# Altium project DISCO Motor Speed Drive 3-0002.PrjPcb
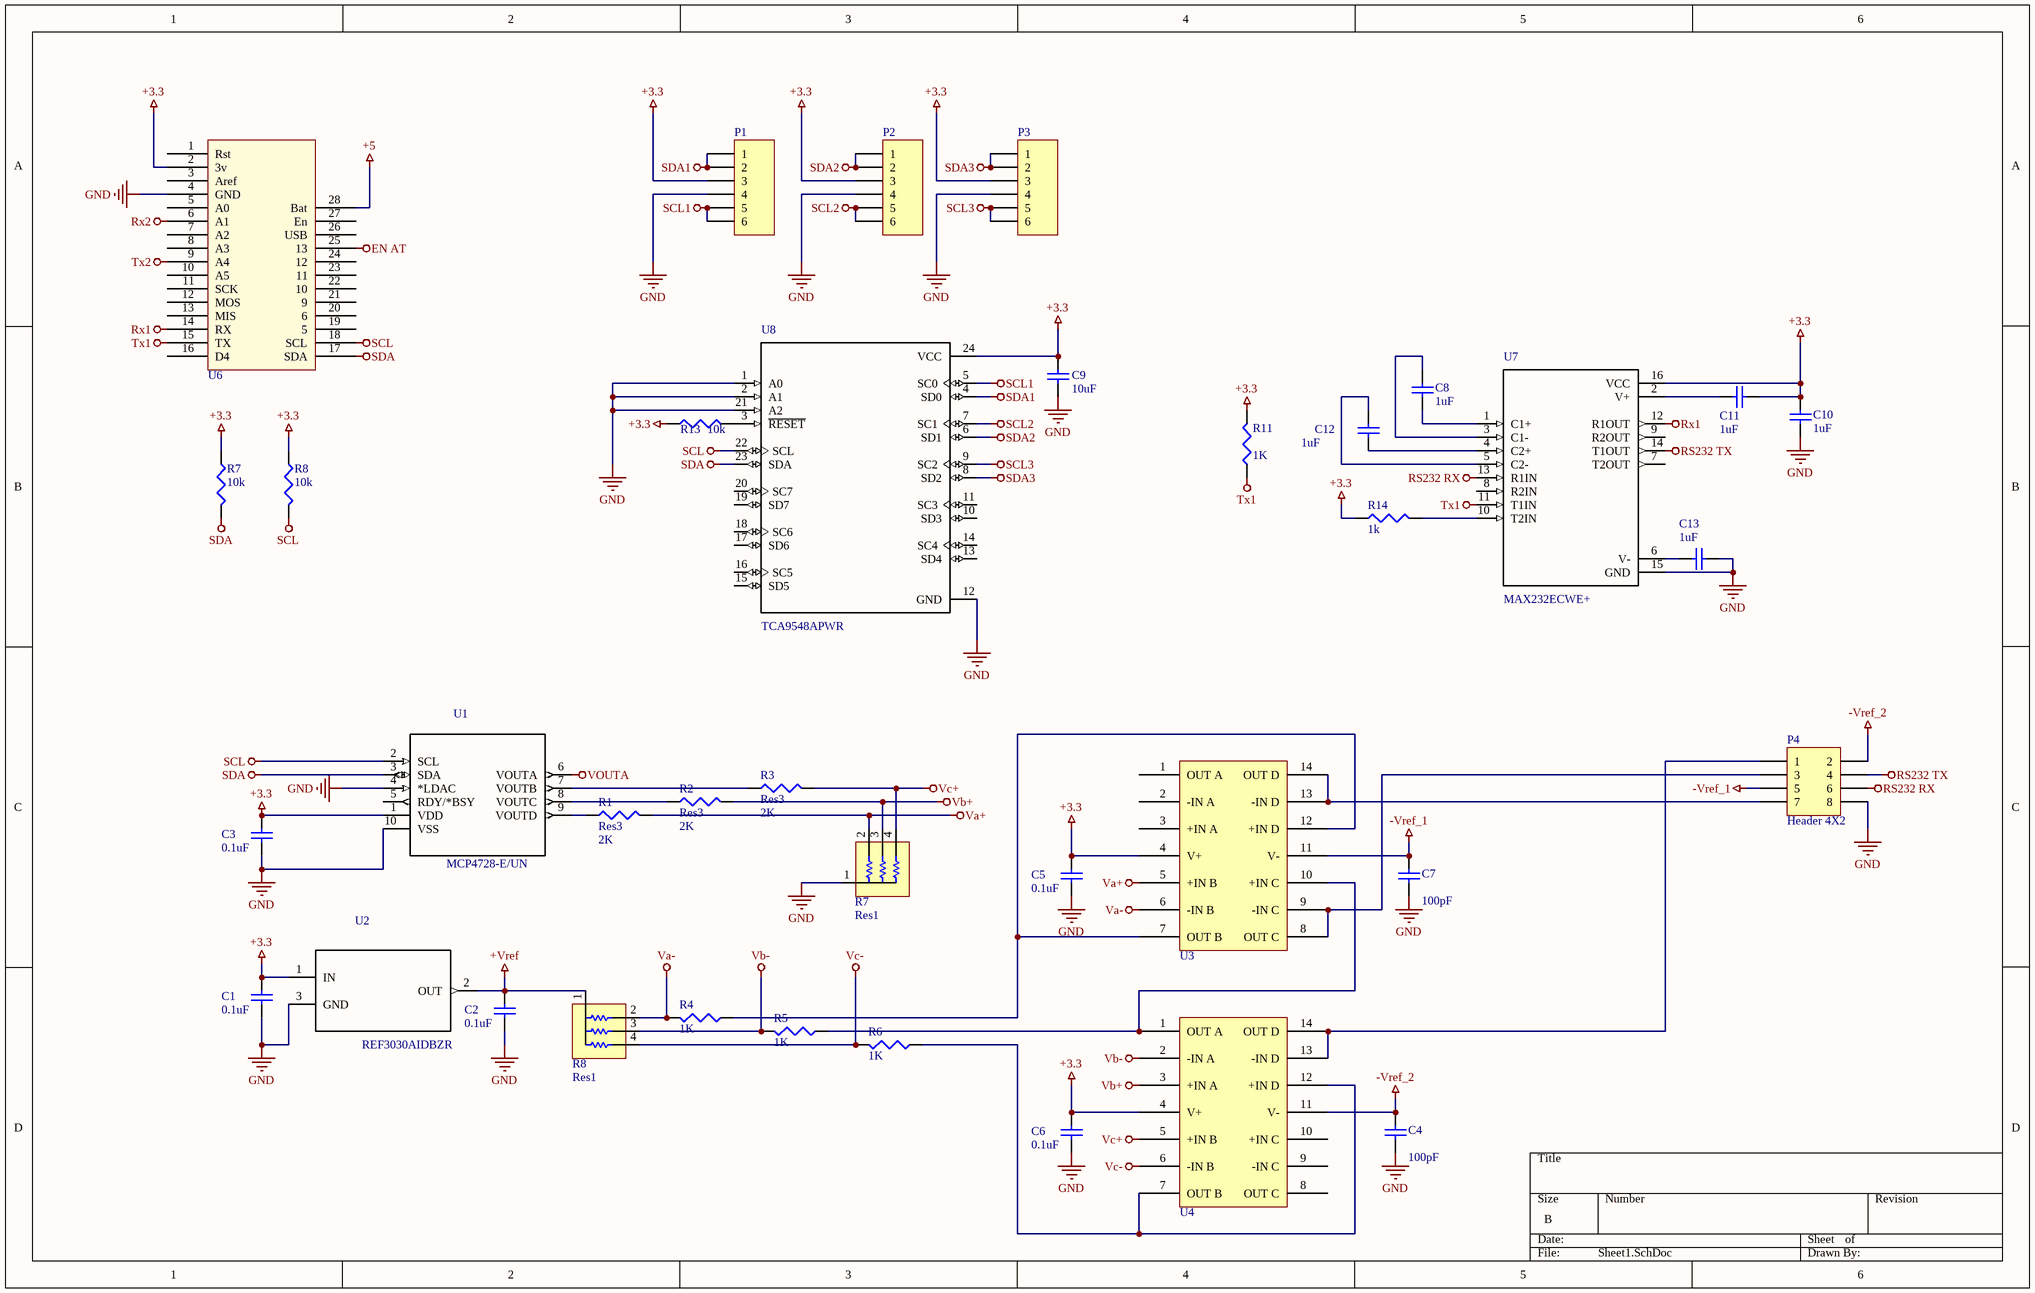
[diagram p0: Sheet1.SchDoc]
1 sheet, 37 parts. Net scope: global (net labels, ports and power ports of the same name join across sheets).

## Sheet Sheet1.SchDoc
size B

### Parts
(Parts that share a designator on the sheet are numbered #1, #2 ... from top to bottom, then left to right.)
C1  value 0.1uF  [1608[0603]]  (hidden comment: Cap Semi)
C2  value 0.1uF  [1608[0603]]  (hidden comment: Cap Semi)
C3  value 0.1uF  [1608[0603]]  (hidden comment: Cap Semi)
C4  value 100pF  [1608[0603]]  (hidden comment: Cap Semi)
C5  value 0.1uF  [1608[0603]]  (hidden comment: Cap Semi)
C6  value 0.1uF  [1608[0603]]  (hidden comment: Cap Semi)
C7  value 100pF  [1608[0603]]  (hidden comment: Cap Semi)
C8  value 1uF  [1608[0603]]  (hidden comment: Cap Semi)
C9  value 10uF  [1608[0603]]  (hidden comment: Cap Semi)
C10  value 1uF  [1608[0603]]  (hidden comment: Cap Semi)
C11  value 1uF  [1608[0603]]  (hidden comment: Cap Semi)
C12  value 1uF  [1608[0603]]  (hidden comment: Cap Semi)
C13  value 1uF  [1608[0603]]  (hidden comment: Cap Semi)
P1  Header 6  [flow sensor]  (value not drawn)
P2  Header 6  [flow sensor]  (value not drawn)
P3  Header 6  [flow sensor]  (value not drawn)
P4  Header 4X2  [Molex MicroFit 2x4]
R1  Res3  value 2K  [J1-0603]
R2  Res3  value 2K  [J1-0603]
R3  Res3  value 2K  [J1-0603]
R4  value 1K  [0402]  (hidden comment: Res3)
R5  value 1K  [0402]  (hidden comment: Res3)
R6  value 1K  [0402]  (hidden comment: Res3)
R7#1  value 10k  [0402]  (hidden comment: Res3)
R7#2  Res1  [resistor Bus]
R8#1  value 10k  [0402]  (hidden comment: Res3)
R8#2  Res1  [resistor Bus]
R11  value 1K  [J1-0603]  (hidden comment: Res3)
R13  value 10k  [0402]  (hidden comment: Res3)
R14  value 1k  [J1-0603]  (hidden comment: Res3)
U1  MCP4728-E/UN  [*SOP50P490X110-10N]
U2  REF3030AIDBZR  [*SOT95P237X112-3N]
U3  TLV6004  [*SOP65P640X120-14N]  (value not drawn)
U4  TLV6004  [*SOP65P640X120-14N]  (value not drawn)
U6  Feather M4  [*ADAFRUIT_2829_2829(Primary)]  (value not drawn)
U7  MAX232ECWE+  [*SOIC127P1032X265-16N]
U8  TCA9548APWR  [*SOP65P640X120-24N]

### Nets
+3.3: C1.2 C3.2 C5.2 C6.2 C9.1 C10.1 C11.1 P1.3 P2.3 P3.3 R7#1.1 R8#1.1 R11.2 R13.1 R14.1 U1.1(VDD) U2.1(IN) U3.4(V+) U4.4(V+) U6.2(3v) U7.16(VCC) U8.24(VCC)
+5: U6.28(Bat)
+Vref: C2.2 R8#2.1 U2.2(OUT)
-Vref_1: C7.2 P4.5 U3.11(V-)
-Vref_2: C4.2 P4.2 U4.11(V-)
EN AT: U6.25(13)
GND: C1.1 C2.1 C3.1 C4.1 C5.1 C6.1 C7.1 C9.2 C10.2 C13.1 P1.4 P2.4 P3.4 P4.8 R7#2.1 U1.4(*LDAC) U1.10(VSS) U2.3(GND) U6.4(GND) U7.15(GND) U8.1(A0) U8.2(A1) U8.12(GND) U8.21(A2)
RS232 RX: P4.6 U7.13(R1IN)
RS232 TX: P4.4 U7.14(T1OUT)
Rx1: U6.14(RX) U7.12(R1OUT)
Rx2: U6.6(A1)
SCL: R8#1.2 U1.2(SCL) U6.18(SCL) U8.22(SCL)
SCL1: P1.5 P1.6 U8.5(SC0)
SCL2: P2.5 P2.6 U8.7(SC1)
SCL3: P3.5 P3.6 U8.9(SC2)
SDA: R7#1.2 U1.3(SDA) U6.17(SDA) U8.23(SDA)
SDA1: P1.1 P1.2 U8.4(SD0)
SDA2: P2.1 P2.2 U8.6(SD1)
SDA3: P3.1 P3.2 U8.8(SD2)
Tx1: R11.1 U6.15(TX) U7.11(T1IN)
Tx2: U6.9(A4)
Va+: R1.2 R7#2.2 U3.5(+IN_B)
Va-: R4.2 R8#2.2 U3.6(-IN_B)
Vb+: R2.2 R7#2.3 U4.3(+IN_A)
Vb-: R5.2 R8#2.3 U4.2(-IN_A)
Vc+: R3.2 R7#2.4 U4.5(+IN_B)
Vc-: R6.2 R8#2.4 U4.6(-IN_B)
VOUTA: U1.6(VOUTA)
NetC8_1: C8.1 U7.3(C1-)
NetC8_2: C8.2 U7.1(C1+)
NetC11_2: C11.2 U7.2(V+)
NetC12_1: C12.1 U7.5(C2-)
NetC12_2: C12.2 U7.4(C2+)
NetC13_2: C13.2 U7.6(V-)
NetP4_1: P4.1 U4.13(-IN_D) U4.14(OUT_D)
NetP4_3: P4.3 U3.8(OUT_C) U3.9(-IN_C)
NetP4_7: P4.7 U3.13(-IN_D) U3.14(OUT_D)
NetR1_1: R1.1 U1.9(VOUTD)
NetR2_1: R2.1 U1.8(VOUTC)
NetR3_1: R3.1 U1.7(VOUTB)
NetR4_1: R4.1 U3.7(OUT_B) U3.12(+IN_D)
NetR5_1: R5.1 U3.10(+IN_C) U4.1(OUT_A)
NetR6_1: R6.1 U4.7(OUT_B) U4.12(+IN_D)
NetR13_2: R13.2 U8.3(~{RESET})
NetR14_2: R14.2 U7.10(T2IN)

Not connected (* = marked no-connect by the designer): U1 5(RDY/*BSY); U3 1(OUT_A) 2(-IN_A) 3(+IN_A); U4 8(OUT_C) 9(-IN_C) 10(+IN_C); U6 1(Rst) 3(Aref) 5(A0) 7(A2) 8(A3) 10(A5) 11(SCK) 12(MOS) 13(MIS) 16(D4) 19(5) 20(6) 21(9) 22(10) 23(11) 24(12) 26(USB) 27(En); U7 7(T2OUT) 8(R2IN) 9(R2OUT); U8 10(SD3) 11(SC3) 13(SD4) 14(SC4) 15(SD5) 16(SC5) 17(SD6) 18(SC6) 19(SD7) 20(SC7)

### Library data of the parts
C1-C13 = Cap Semi: Capacitor (Semiconductor SIM Model); Published: 8-Jun-2000; LatestRevisionDate: 29-May-2009; LatestRevisionNote: IPC-7351 Footprint Added.; PackageReference: C1206; Publisher: Altium Limited; PackageDescription: Chip Capacitor
P1-P3 = Header 6: Header, 6-Pin; LatestRevisionDate: 17-Jul-2002; LatestRevisionNote: Re-released for DXP Platform.; Publisher: Altium Limited
P4 = Header 4X2: Header, 4-Pin, Dual row; LatestRevisionDate: 17-Jul-2002; LatestRevisionNote: Re-released for DXP Platform.; Publisher: Altium Limited
R1-R6 R7#1 R8#1 R11 R13 R14 = Res3: Resistor; Published: 8-Jun-2000; LatestRevisionDate: 29-May-2009; LatestRevisionNote: IPC-7351 Footprint Added.; PackageReference: J1-0603; Publisher: Altium Limited; PackageDescription: Chip Resistor
R7#2 R8#2 U3 U4 = Component_1
U1 = MCP4728-E/UN: MCP4728 Series 4 Ch I2C EEPROM Memory 5.5 V 12-Bit D/A Converter SMT - MSOP-10; MF: Microchip; Package: MSOP-10 Microchip; MP: MCP4728-E/UN; Digi-Key_Purchase_URL: https://www.digikey.com/product-detail/en/microchip-technology/MCP4728-E-UN/MCP4728-E-UN-ND/2125526?utm_source=snapeda&utm_medium=aggregator&utm_campaign=symbol; Digi-Key_Part_Number: MCP4728-E/UN-ND; SnapEDA_Link: https://www.snapeda.com/parts/MCP4728-E/UN/Microchip/view-part/?ref=snap; Value: *
U2 = REF3030AIDBZR: 3.0V 50ppm/Degrees C, 50uA in SOT23-3 Series _Bandgap_ Voltage Reference 3-SOT-23 -40 to 125; MF: Texas Instruments; Price: None; SnapEDA_Link: https://www.snapeda.com/parts/REF3030AIDBZR/Texas%20Instruments/view-part/?ref=snap; Availability: Unavailable; MP: REF3030AIDBZR; Package: SOT-23-3 Texas Instruments; Value: *
U7 = MAX232ECWE+: Dual Transmitter/Receiver RS-232 16-Pin SOIC W; MF: Maxim Integrated; SnapEDA_Link: https://www.snapeda.com/parts/MAX232ECWE%2B/Maxim%20Integrated/view-part/?ref=snap; Availability: Unavailable; MP: MAX232ECWE+; Price: None; Package: SOIC-16 Maxim; Value: *
U8 = TCA9548APWR: Low-Voltage 8-Channel I2C Switch With Reset 24-TSSOP -40 to 85; MF: Texas Instruments; Package: TSSOP-24 Texas Instruments; MP: TCA9548APWR; SnapEDA_Link: https://www.snapeda.com/parts/TCA9548APWR/Texas%20Instruments/view-part/?ref=snap; Price: None; Availability: Unavailable; Value: *